# Altium schematic sheet UM220 NEO-M8.SchDoc
size A4
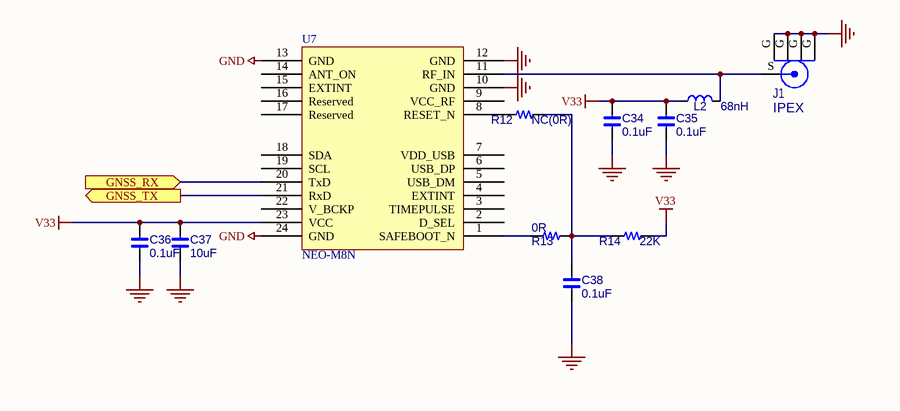
[diagram p0: UM220 NEO-M8.SchDoc]

## Parts
C34  0.1uF  [0402CAPC1005X06N]
C35  0.1uF  [0402CAPC1005X06N]
C36  0.1uF  [0402CAPC1005X06N]
C37  10uF  [0603CAPC1608X09N]
C38  0.1uF  [0402CAPC1005X06N]
J1  IPEX  [IPEX]
L2  68nH  [0402RESC1005X04N]
R12  NC(0R)  [0402RESC1005X04N]
R13  0R  [0402RESC1005X04N]
R14  22K  [0402RESC1005X04N]
U7  NEO-M8N  [UM220]

## Ports
GNSS_RX (in), GNSS_TX (out)

## Nets
GND: C34.2 C35.2 C36.2 C37.2 C38.2 J1.G(Ground) U7.10(GND) U7.12(GND) U7.13(GND) U7.24(GND)
V33: C34.1 C35.1 C36.1 C37.1 L2.1 R14.2 U7.23(VCC)
GNSS_RX: U7.20(TxD) ; port GNSS_RX
GNSS_TX: U7.21(RxD) ; port GNSS_TX
NetC38_1: C38.1 R12.2 R13.2 R14.1
NetJ1_S: J1.S(Signal) L2.2 U7.11(RF_IN)
NetR12_1: R12.1 U7.8(RESET_N)
NetR13_1: R13.1 U7.1(SAFEBOOT_N)

Not connected (* = marked no-connect by the designer): U7 2(D_SEL) 3(TIMEPULSE) 4(EXTINT) 5(USB_DM) 6(USB_DP) 7(VDD_USB) 9(VCC_RF) 14(ANT_ON) 15(EXTINT) 16(Reserved) 17(Reserved) 18(SDA) 19(SCL) 22(V_BCKP)

## Library data of the parts
C34-C38 = C
J1 = RF Connector: Published: 2013.8.4; Publisher: ChenTao; PackageVersion: ver1.0
L2 = L
R12-R14 = R